# Altium schematic sheet HDMI_INPUT_AD9398.SchDoc: HDMI Video Receiver
size A4; Organization: Altium Limited.; Address1: Level 3, 12a Rodborough Rd; Address2: Frenchs Forest 2086; Address3: NSW; Address4: AUSTRALIA; SheetNumber: 10; SheetTotal: 100
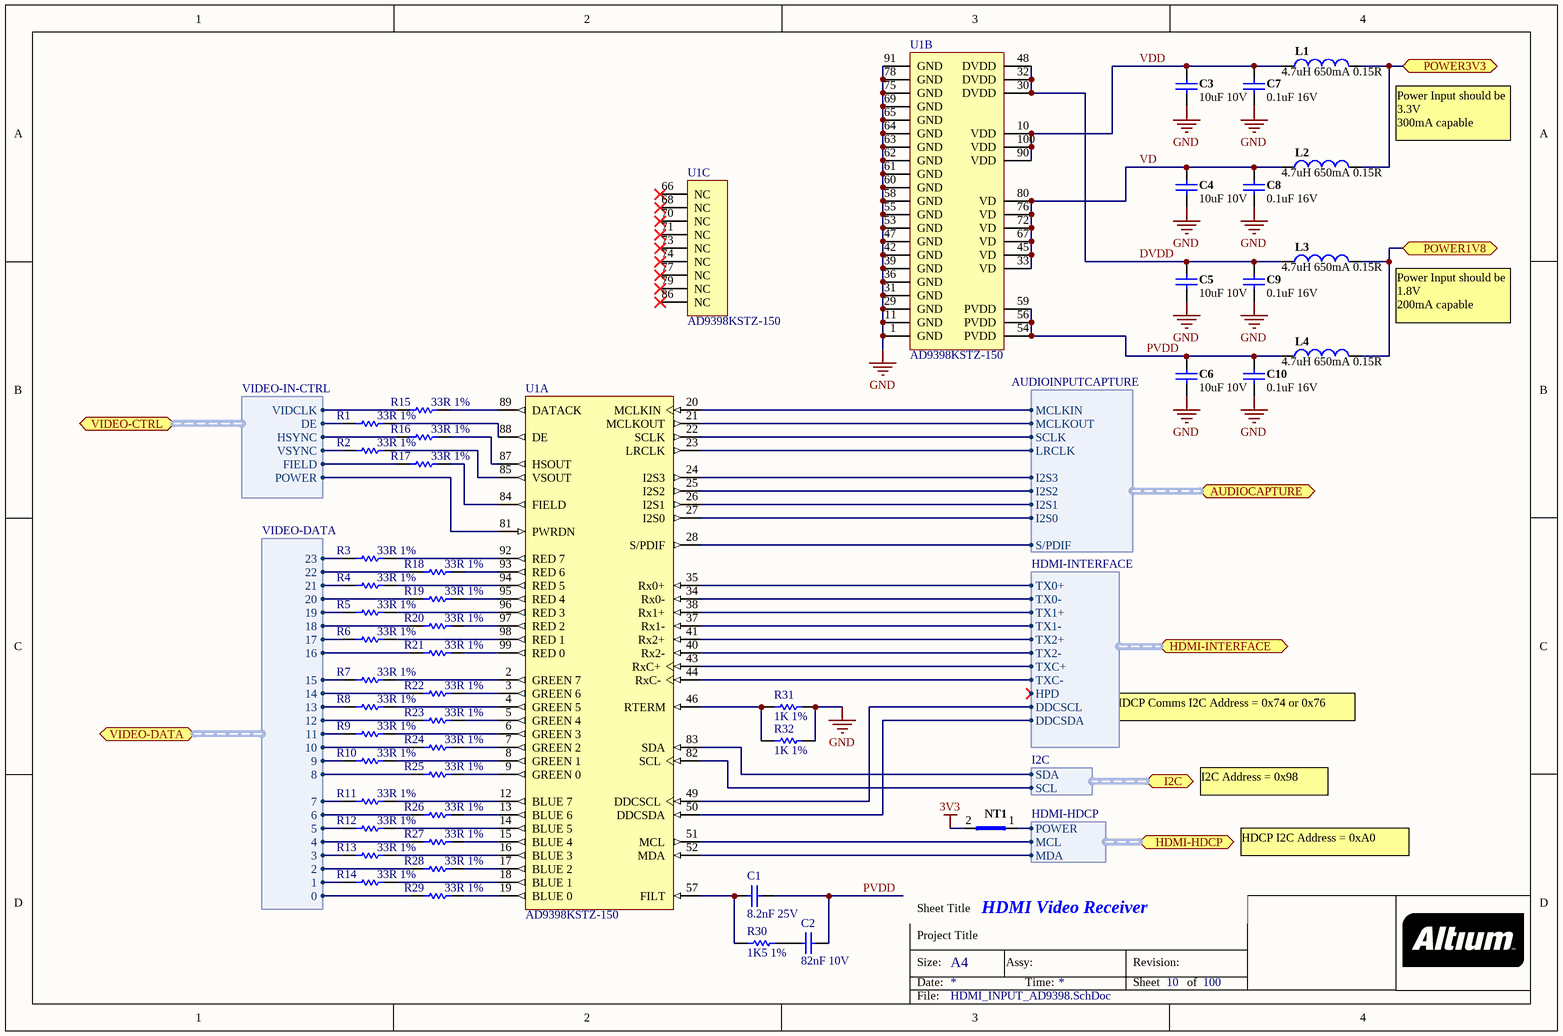
[diagram p0: HDMI_INPUT_AD9398.SchDoc]

## Parts
C1  8.2nF 25V  [CAPC1005-STAR]
C2  82nF 10V  [CAPC1005-STAR]
C3  10uF 10V  [CAPC2012-STAR]
C4  10uF 10V  [CAPC2012-STAR]
C5  10uF 10V  [CAPC2012-STAR]
C6  10uF 10V  [CAPC2012-STAR]
C7  0.1uF 16V  [CAPC1005-STAR]
C8  0.1uF 16V  [CAPC1005-STAR]
C9  0.1uF 16V  [CAPC1005-STAR]
C10  0.1uF 16V  [CAPC1005-STAR]
L1  4.7uH 650mA 0.15R  [INDC3225]
L2  4.7uH 650mA 0.15R  [INDC3225]
L3  4.7uH 650mA 0.15R  [INDC3225]
L4  4.7uH 650mA 0.15R  [INDC3225]
NT1  Net Tie SMT2  [NETTIE-SMT2-31X39]  (value not drawn)  (net tie, no BOM)
R1  33R 1%  [RESC1005-STAR]
R2  33R 1%  [RESC1005-STAR]
R3  33R 1%  [RESC1005-STAR]
R4  33R 1%  [RESC1005-STAR]
R5  33R 1%  [RESC1005-STAR]
R6  33R 1%  [RESC1005-STAR]
R7  33R 1%  [RESC1005-STAR]
R8  33R 1%  [RESC1005-STAR]
R9  33R 1%  [RESC1005-STAR]
R10  33R 1%  [RESC1005-STAR]
R11  33R 1%  [RESC1005-STAR]
R12  33R 1%  [RESC1005-STAR]
R13  33R 1%  [RESC1005-STAR]
R14  33R 1%  [RESC1005-STAR]
R15  33R 1%  [RESC1005-STAR]
R16  33R 1%  [RESC1005-STAR]
R17  33R 1%  [RESC1005-STAR]
R18  33R 1%  [RESC1005-STAR]
R19  33R 1%  [RESC1005-STAR]
R20  33R 1%  [RESC1005-STAR]
R21  33R 1%  [RESC1005-STAR]
R22  33R 1%  [RESC1005-STAR]
R23  33R 1%  [RESC1005-STAR]
R24  33R 1%  [RESC1005-STAR]
R25  33R 1%  [RESC1005-STAR]
R26  33R 1%  [RESC1005-STAR]
R27  33R 1%  [RESC1005-STAR]
R28  33R 1%  [RESC1005-STAR]
R29  33R 1%  [RESC1005-STAR]
R30  1K5 1%  [RESC1005-STAR]
R31  1K 1%  [RESC1005-STAR]
R32  1K 1%  [RESC1005-STAR]
U1  AD9398KSTZ-150  [ST-100-1_V]  (parts A,B,C of 3)

## Ports
AUDIOCAPTURE (harness AUDIOINPUTCAPTURE), HDMI-HDCP (harness HDMI-HDCP), HDMI-INTERFACE (harness HDMI-INTERFACE), I2C (harness I2C), POWER1V8, POWER3V3, VIDEO-CTRL (harness VIDEO-IN-CTRL), VIDEO-DATA (harness VIDEO-DATA)

## Harnesses
I2C: SCL, SDA
AUDIOINPUTCAPTURE: I2S0, I2S1, I2S2, I2S3, LRCLK, MCLKIN, S/PDIF, SCLK, MCLKOUT
VIDEO-IN-CTRL: DE, HSYNC, VIDCLK, VSYNC, FIELD, POWER
VIDEO-DATA: 0, 1, 10, 11, 12, 13, 14, 15, 16, 17, 18, 19, 2, 20, 21, 22, 23, 3, 4, 5, 6, 7, 8, 9
HDMI-INTERFACE: TX0+, TX0-, TX1+, TX1-, TX2+, TX2-, TXC+, TXC-, DDCSDA, DDCSCL, HPD
HDMI-HDCP: POWER, MCL, MDA

## Nets
3V3: NT1.2(Net2)
GND: C3.2 C4.2 C5.2 C6.2 C7.2 C8.2 C9.2 C10.2 R31.2 R32.2 U1.1(GND) U1.11(GND) U1.29(GND) U1.31(GND) U1.36(GND) U1.39(GND) U1.42(GND) U1.47(GND) U1.53(GND) U1.55(GND) U1.58(GND) U1.60(GND) U1.61(GND) U1.62(GND) U1.63(GND) U1.64(GND) U1.65(GND) U1.69(GND) U1.75(GND) U1.78(GND) U1.91(GND)
DVDD: C5.1 C9.1 L3.2 U1.30(DVDD) U1.32(DVDD) U1.48(DVDD)
POWER1V8: L3.1 L4.1 ; port POWER1V8
POWER3V3: L1.1 L2.1 ; port POWER3V3
PVDD: C1.2 C2.2 C6.1 C10.1 L4.2 U1.54(PVDD) U1.56(PVDD) U1.59(PVDD)
VD: C4.1 C8.1 L2.2 U1.33(VD) U1.45(VD) U1.67(VD) U1.72(VD) U1.76(VD) U1.80(VD)
VDD: C3.1 C7.1 L1.2 U1.10(VDD) U1.90(VDD) U1.100(VDD)
NetC1_1: C1.1 R30.1 U1.57(FILT)
NetC2_1: C2.1 R30.2
NetNT1_1: NT1.1(Net1) ; port HDMI-HDCP.POWER
NetR1_1: R1.1 ; port VIDEO-CTRL.DE
NetR1_2: R1.2 U1.88(DE)
NetR2_1: R2.1 ; port VIDEO-CTRL.VSYNC
NetR2_2: R2.2 U1.85(VSOUT)
NetR3_1: R3.1 ; port VIDEO-DATA.23
NetR3_2: R3.2 U1.92(RED_7)
NetR4_1: R4.1 ; port VIDEO-DATA.21
NetR4_2: R4.2 U1.94(RED_5)
NetR5_1: R5.1 ; port VIDEO-DATA.19
NetR5_2: R5.2 U1.96(RED_3)
NetR6_1: R6.1 ; port VIDEO-DATA.17
NetR6_2: R6.2 U1.98(RED_1)
NetR7_1: R7.1 ; port VIDEO-DATA.15
NetR7_2: R7.2 U1.2(GREEN_7)
NetR8_1: R8.1 ; port VIDEO-DATA.13
NetR8_2: R8.2 U1.4(GREEN_5)
NetR9_1: R9.1 ; port VIDEO-DATA.11
NetR9_2: R9.2 U1.6(GREEN_3)
NetR10_1: R10.1 ; port VIDEO-DATA.9
NetR10_2: R10.2 U1.8(GREEN_1)
NetR11_1: R11.1 ; port VIDEO-DATA.7
NetR11_2: R11.2 U1.12(BLUE_7)
NetR12_1: R12.1 ; port VIDEO-DATA.5
NetR12_2: R12.2 U1.14(BLUE_5)
NetR13_1: R13.1 ; port VIDEO-DATA.3
NetR13_2: R13.2 U1.16(BLUE_3)
NetR14_1: R14.1 ; port VIDEO-DATA.1
NetR14_2: R14.2 U1.18(BLUE_1)
NetR15_1: R15.1 ; port VIDEO-CTRL.VIDCLK
NetR15_2: R15.2 U1.89(DATACK)
NetR16_1: R16.1 ; port VIDEO-CTRL.HSYNC
NetR16_2: R16.2 U1.87(HSOUT)
NetR17_1: R17.1 ; port VIDEO-CTRL.FIELD
NetR17_2: R17.2 U1.84(FIELD)
NetR18_1: R18.1 ; port VIDEO-DATA.22
NetR18_2: R18.2 U1.93(RED_6)
NetR19_1: R19.1 ; port VIDEO-DATA.20
NetR19_2: R19.2 U1.95(RED_4)
NetR20_1: R20.1 ; port VIDEO-DATA.18
NetR20_2: R20.2 U1.97(RED_2)
NetR21_1: R21.1 ; port VIDEO-DATA.16
NetR21_2: R21.2 U1.99(RED_0)
NetR22_1: R22.1 ; port VIDEO-DATA.14
NetR22_2: R22.2 U1.3(GREEN_6)
NetR23_1: R23.1 ; port VIDEO-DATA.12
NetR23_2: R23.2 U1.5(GREEN_4)
NetR24_1: R24.1 ; port VIDEO-DATA.10
NetR24_2: R24.2 U1.7(GREEN_2)
NetR25_1: R25.1 ; port VIDEO-DATA.8
NetR25_2: R25.2 U1.9(GREEN_0)
NetR26_1: R26.1 ; port VIDEO-DATA.6
NetR26_2: R26.2 U1.13(BLUE_6)
NetR27_1: R27.1 ; port VIDEO-DATA.4
NetR27_2: R27.2 U1.15(BLUE_4)
NetR28_1: R28.1 ; port VIDEO-DATA.2
NetR28_2: R28.2 U1.17(BLUE_2)
NetR29_1: R29.1 ; port VIDEO-DATA.0
NetR29_2: R29.2 U1.19(BLUE_0)
NetR31_1: R31.1 R32.1 U1.46(RTERM)
NetU1_20: U1.20(MCLKIN) ; port AUDIOCAPTURE.MCLKIN
NetU1_21: U1.21(MCLKOUT) ; port AUDIOCAPTURE.MCLKOUT
NetU1_22: U1.22(SCLK) ; port AUDIOCAPTURE.SCLK
NetU1_23: U1.23(LRCLK) ; port AUDIOCAPTURE.LRCLK
NetU1_24: U1.24(I2S3) ; port AUDIOCAPTURE.I2S3
NetU1_25: U1.25(I2S2) ; port AUDIOCAPTURE.I2S2
NetU1_26: U1.26(I2S1) ; port AUDIOCAPTURE.I2S1
NetU1_27: U1.27(I2S0) ; port AUDIOCAPTURE.I2S0
NetU1_28: U1.28(S/PDIF) ; port AUDIOCAPTURE.S/PDIF
NetU1_34: U1.34(Rx0-) ; port HDMI-INTERFACE.TX0-
NetU1_35: U1.35(Rx0+) ; port HDMI-INTERFACE.TX0+
NetU1_37: U1.37(Rx1-) ; port HDMI-INTERFACE.TX1-
NetU1_38: U1.38(Rx1+) ; port HDMI-INTERFACE.TX1+
NetU1_40: U1.40(Rx2-) ; port HDMI-INTERFACE.TX2-
NetU1_41: U1.41(Rx2+) ; port HDMI-INTERFACE.TX2+
NetU1_43: U1.43(RxC+) ; port HDMI-INTERFACE.TXC+
NetU1_44: U1.44(RxC-) ; port HDMI-INTERFACE.TXC-
NetU1_49: U1.49(DDCSCL) ; port HDMI-INTERFACE.DDCSCL
NetU1_50: U1.50(DDCSDA) ; port HDMI-INTERFACE.DDCSDA
NetU1_51: U1.51(MCL) ; port HDMI-HDCP.MCL
NetU1_52: U1.52(MDA) ; port HDMI-HDCP.MDA
NetU1_81: U1.81(PWRDN) ; port VIDEO-CTRL.POWER
NetU1_82: U1.82(SCL) ; port I2C.SCL
NetU1_83: U1.83(SDA) ; port I2C.SDA

Not connected (* = marked no-connect by the designer): U1 66(NC)* 68(NC)* 70(NC)* 71(NC)* 73(NC)* 74(NC)* 77(NC)* 79(NC)* 86(NC)*

## Notes on the sheet
- Power Input should be 3.3V
  300mA capable
- Power Input should be 1.8V
  200mA capable
- HDCP Comms I2C Address = 0x74 or 0x76
- I2C Address = 0x98
- HDCP I2C Address = 0xA0
- Sheet Title
- Project Title
- Size:
- Date:
- A4
- Assy:
- Time:
- Revision:
- Sheet
- of
- File:

## Library data of the parts
C1 = D-101-0128: Capacitor, Ceramic, 8.2nF, X7R, 25V, 10%, 0402; Polarity: Non-Polarized; Rated Voltage: mV; Capacitance: 8.2 nF; Dielectric: X7R; Mounting Technology: Surface Mount; Status: Production; Technology: Ceramic; Tolerance: 10 %; Category: Capacitor
C2 = D-101-0129: Capacitor, Ceramic, 82nF, X5R, 10V, 10%, 0402; Polarity: Non-Polarized; Rated Voltage: mV; Capacitance: 82 nF; Dielectric: X5R; Mounting Technology: Surface Mount; Status: Production; Technology: Ceramic; Tolerance: 10 %; Category: Capacitor
C3-C6 = D-101-0087: Capacitor, Ceramic, 10uF 10% 10V 0805 (2012) X5R; Polarity: Non-Polarized; Capacitance: 10 uF; Category: Capacitor; Dielectric: X5R; Mounting Technology: Surface Mount; Rated Voltage: 10 V; Status: Unreleased; Technology: None; Tolerance: 10 %
C7-C10 = D-101-0080: Capacitor, Ceramic, 0.1uF 10% 16V 0402 (1005) X7R; Polarity: Non-Polarized; Capacitance: 0.1 uF; Category: Capacitor; Dielectric: X7R; Mounting Technology: Surface Mount; Rated Voltage: 16 V; Status: Production; Technology: Ceramic; Tolerance: 10 %
L1-L4 = D-102-0005: Inductor, 4.7uH 650mA 0.15R 1210 (3225) LQH32CN4R7M11L; Category: Inductor; Status: Production
NT1 = D-002-0004: Net-Tie, Surface Mount, 2 x 2.0mm x 0.8mm SMT Pads - For 0.8mm Track; Status: Production; Category: Net-Tie
R1-R29 = D-100-0102: Resistor, 33R 1% 0402 (1005); Power Rating: 63 mW; Mounting Technology: Surface Mount; Resistance: 33 R; Status: Production; Tolerance: 1 %; Category: Resistor
R30 = D-100-0003: Resistor, 1K5 1% 0402; Power Rating: mW; Resistance: mR; Tolerance: %; Mounting Technology: Surface Mount; Status: Unreleased; Category: Resistor
R31 R32 = D-100-0121: Resistor, 1K 1% 0402 (1005); Power Rating: 63 mW; Mounting Technology: Surface Mount; Resistance: 1 K; Status: Production; Tolerance: 1 %; Category: Resistor
U1 = D-202-0005: AD9398KSTZ-150, HDMI Video Receiver, TQFP100; Supply Voltage: mV; Mounting Technology: Surface Mount; Status: Production; Category: IC-Video